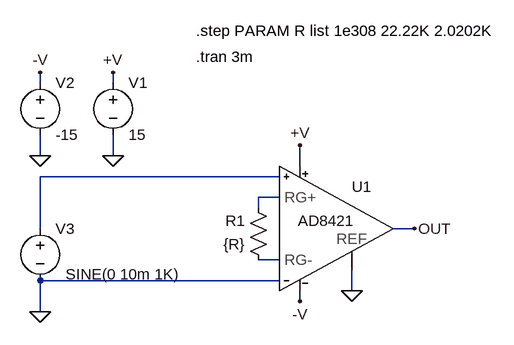
[diagram p0: schematic AD8421_test2.asc]
AD8421_test2.asc, the LTspice schematic file:
Version 4
SHEET 1 896 680
WIRE -16 -16 -16 -32
WIRE 96 -16 96 -32
WIRE -16 96 -16 64
WIRE 96 96 96 64
WIRE 384 112 384 80
WIRE 352 128 -16 128
WIRE 352 160 320 160
WIRE 320 176 320 160
WIRE -16 208 -16 128
WIRE 560 208 528 208
WIRE 352 256 320 256
WIRE 352 288 -16 288
WIRE 464 304 464 272
WIRE 384 320 384 304
WIRE -16 336 -16 288
FLAG 96 96 0
FLAG 96 -32 +V
FLAG -16 96 0
FLAG -16 -32 -V
FLAG 384 80 +V
FLAG 384 320 -V
FLAG -16 336 0
FLAG 560 208 OUT
FLAG 464 304 0
SYMBOL voltage 96 -32 R0
SYMATTR InstName V1
SYMATTR Value 15
SYMBOL voltage -16 -32 R0
SYMATTR InstName V2
SYMATTR Value -15
SYMBOL res 336 272 R180
WINDOW 0 36 76 Left 2
WINDOW 3 36 40 Left 2
SYMATTR InstName R1
SYMATTR Value {R}
SYMBOL voltage -16 192 R0
WINDOW 3 39 86 Left 2
SYMATTR Value SINE(0 10m 1K)
SYMATTR InstName V3
SYMBOL MyLibrary\\ad8421\\AD8421 384 208 R0
SYMATTR InstName U1
TEXT 224 -56 Left 2 !.tran 3m
TEXT 224 -96 Left 2 !.step PARAM R list 1e308 22.22K 2.0202K

The netlist it stands for:
* AD8421_test2.asc
V1 +V 0 15
V2 -V 0 -15
R1 N003 N002 {R}
V3 N001 0 SINE(0 10m 1K)
XU1 N001 N002 N003 0 0 -V OUT +V AD8421  ; pins IN- RG- RG+ IN+ -Vs REF Vout +Vs
.tran 3m
.step PARAM R list 1e308 22.22K 2.0202K
.lib AD8421.CIR
.backanno
.end